# Altium schematic sheet Boost converter.schdoc
size 142 x 79 mm
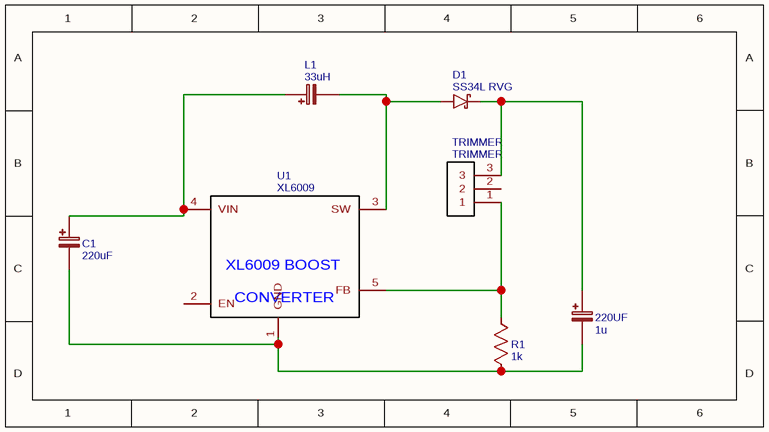
[diagram p0: Boost converter.schdoc]

## Parts
220UF  1u  [CAP-D3.0XF1.5]
C1  220uF  [CAP-D3.0XF1.5]
D1  SS34L RVG  [SMA-FL]
L1  33uH  [CAP-D3.0XF1.5]
R1  1k  [AXIAL-0.3]
TRIMMER  TRIMMER  [TRIMMER]
U1  XL6009  [TO-263-5]

## Nets
Net220UF_1: 220UF.1 D1.2 TRIMMER.3
Net220UF_2: 220UF.2 C1.2 R1.1 U1.1(GND)
NetC1_1: C1.1 L1.1 U1.4(VIN)
NetD1_1: D1.1 L1.2 U1.3(SW)
NetR1_2: R1.2 TRIMMER.1 U1.5(FB)

Not connected (* = marked no-connect by the designer): TRIMMER 2; U1 2(EN)

## Notes on the sheet
- (in symbol XL6009) XL6009 BOOST / CONVERTER

## Library data of the parts
220UF = 1u: nameAlias: Value(F); Contributor: EasyEDA; BOM_Manufacturer Part: ?; spicePre: C; spiceSymbolName: Cap_Electrolytic(TH)_D3.0XF1.5_EU
C1 = 220uF: nameAlias: Value(F); Contributor: EasyEDA; BOM_Manufacturer Part: ?; spicePre: C; spiceSymbolName: Cap_Electrolytic(TH)_D3.0XF1.5_EU
D1 = SS34L RVG: Contributor: Junikos; BOM_Manufacturer Part: ?; spicePre: D
L1 = 33uH: nameAlias: Value(F); Contributor: EasyEDA; BOM_Manufacturer Part: ?; spicePre: C; spiceSymbolName: Cap_Electrolytic(TH)_D3.0XF1.5_EU
R1 = 1k: nameAlias: Value(Ω); BOM_Manufacturer Part: ?; spicePre: R; spiceSymbolName: Res_AXIAL-0.3(1/8W)_US
TRIMMER = TRIMMER: nameAlias: Model; Contributor: juangiraldo04; spicePre: X; BOM_Manufacturer Part: ?; spiceSymbolName: TRIMMER
U1 = XL6009: BOM_Manufacturer: XLSEMI; sourceId: BD9FzR93l; Contributor: GerryChen; BOM_Supplier: LCSC; BOM_Manufacturer Part: XL6009; spicePre: U